# EAGLE design tachometerMv1 (EAGLE 6.2)
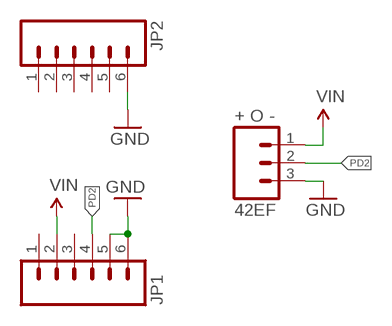
[diagram p0: schematic, sheet 1]

## Parts
42EF  + O -  M03LOCK_LONGPADS  [1X03_LOCK_LONGPADS]
JP1  M06LOCK_LONGPADS  [1X06_LOCK_LONGPADS]
JP2  M06LOCK_LONGPADS  [1X06_LOCK_LONGPADS]

## Nets
GND: 42EF.3 JP1.5 JP1.6 JP2.6
PD2: 42EF.2 JP1.4
VIN: 42EF.1 JP1.2
Unconnected: JP1.1 JP1.3 JP2.1 JP2.2 JP2.3 JP2.4 JP2.5

## Library data of the parts
42EF = SparkFun:M03: Header 3 Standard 3-pin 0.1" header. Use with straight break away headers (SKU : PRT-00116), right angle break away headers (PRT-00553), swiss pins (PRT-00743), machine pins (PRT-00117), and female headers (PRT-00115). Molex polarized connector foot print use with SKU : PRT-08232 with associated crimp pins and housings.
JP1 JP2 = SparkFun:M06: Header 6 Standard 6-pin 0.1" header. Use with straight break away headers (SKU : PRT-00116), right angle break away headers (PRT-00553), swiss pins (PRT-00743), machine pins (PRT-00117), and female headers (PRT-00115). Molex polarized connector foot print use with SKU : PRT-08094 with associated crimp pins and housings. NOTES ON THE VARIANTS LOCK and LOCK_LONGPADS... This footprint was designed to help hold the alignment of a through-hole component (i.e. 6-pin header) while soldering it into place. You may notice that each hole has been shifted either up or down by 0.005 of an inch from it's more standard position (which is a perfectly straight line). This slight alteration caused the pins (the squares in the middle) to touch the edges of the holes. Because they are alternating, it causes a "brace" to hold the component in place. 0.005 has proven to be the perfect amount of "off-center" position when using our standard breakaway headers. Although looks a little odd when you look at the bare footprint, once you have a header in there, the alteration is very hard to notice. Also, if you push a header all the way into place, it is covered up entirely on the bottom side. This idea of altering the position of holes to aid alignment will be further integrated into the Sparkfun Library for other footprints. It can help hold any component with 3 or more connection pins.

## Board
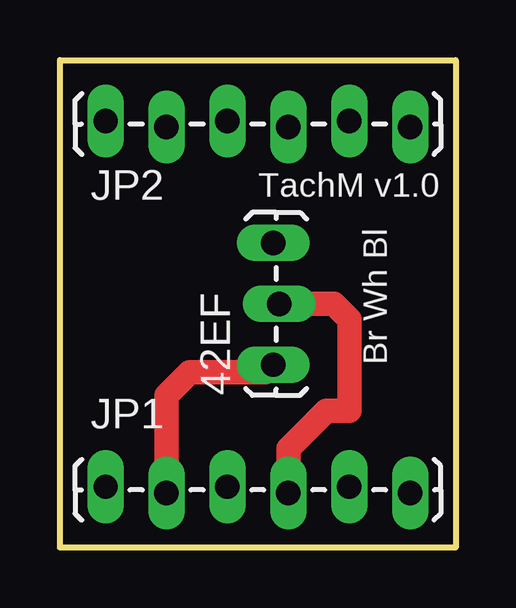
[diagram p1: board, top side]
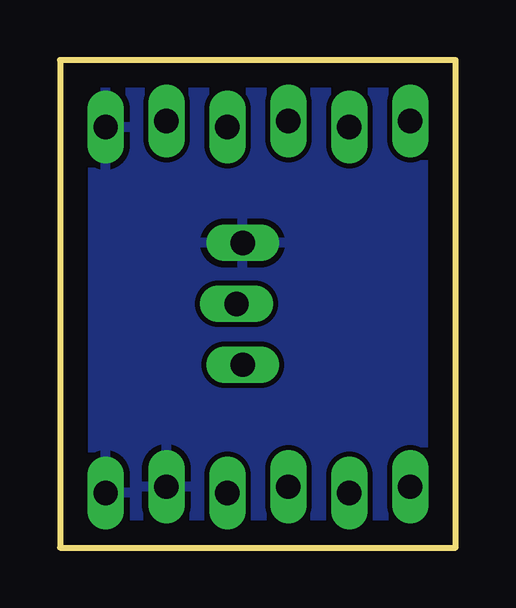
[diagram p2: board, bottom side, seen from below]

Size 16.51 x 20.32 mm. Coordinates in mm from the lower left corner, seen from the top.
Outline: 0,0 0,20.32 16.51,20.32 16.51,0 0,0
Copper layers (1*16): Top 0.035mm / dielectric 1.5mm / Bottom 0.035mm
Design rules: minimum track width 10mil, minimum drill 24mil, track to track 8mil, track to pad 8mil, pad to pad 8mil, via to via 8mil, smd to smd 8mil, copper to edge 40mil, drill to drill 8mil, minimum pad ring 10mil, minimum via ring 8mil, stop-mask expansion 4mil, vias tented up to drill 0mil, thermal gap 10mil

### Footprints (pad centres in the part's own frame; a part is rotated, then mirrored left to right if it is on the bottom)
1X03_LOCK_LONGPADS = drill 1.016 long: 1 0,0; 2 2.54,-0.254; 3 5.08,0
1X06_LOCK_LONGPADS = drill 1.016 long: 1 0,0; 2 2.54,-0.254; 3 5.08,0; 4 7.62,-0.254; 5 10.16,0; 6 12.7,-0.254

### Placement (x,y rotation side)
42EF  8.89,7.62 90 top
JP1  1.91,2.54 0 top
JP2  1.91,17.78 0 top

### Tracks (layer width: path | path; a pad name or v marks a point on that pad's centre or on a via)
GND
  pour Bottom: 0.64,19.68 15.88,19.68 15.88,0.64 0.64,0.64 0.64,19.05
PD2
  Top 1.016: JP1.4 9.53,4.13 11.11,5.71 12.06,5.71 12.06,9.53 11.43,10.16 42EF.2
VIN
  Top 1.016: JP1.2 4.45,6.35 5.4,7.3 8.57,7.3 42EF.1

### Text on the board
tPlace: TachM v1.0 | Br Wh Bl